# EAGLE schematic LDAQ-BASE (EAGLE 9.6.2)
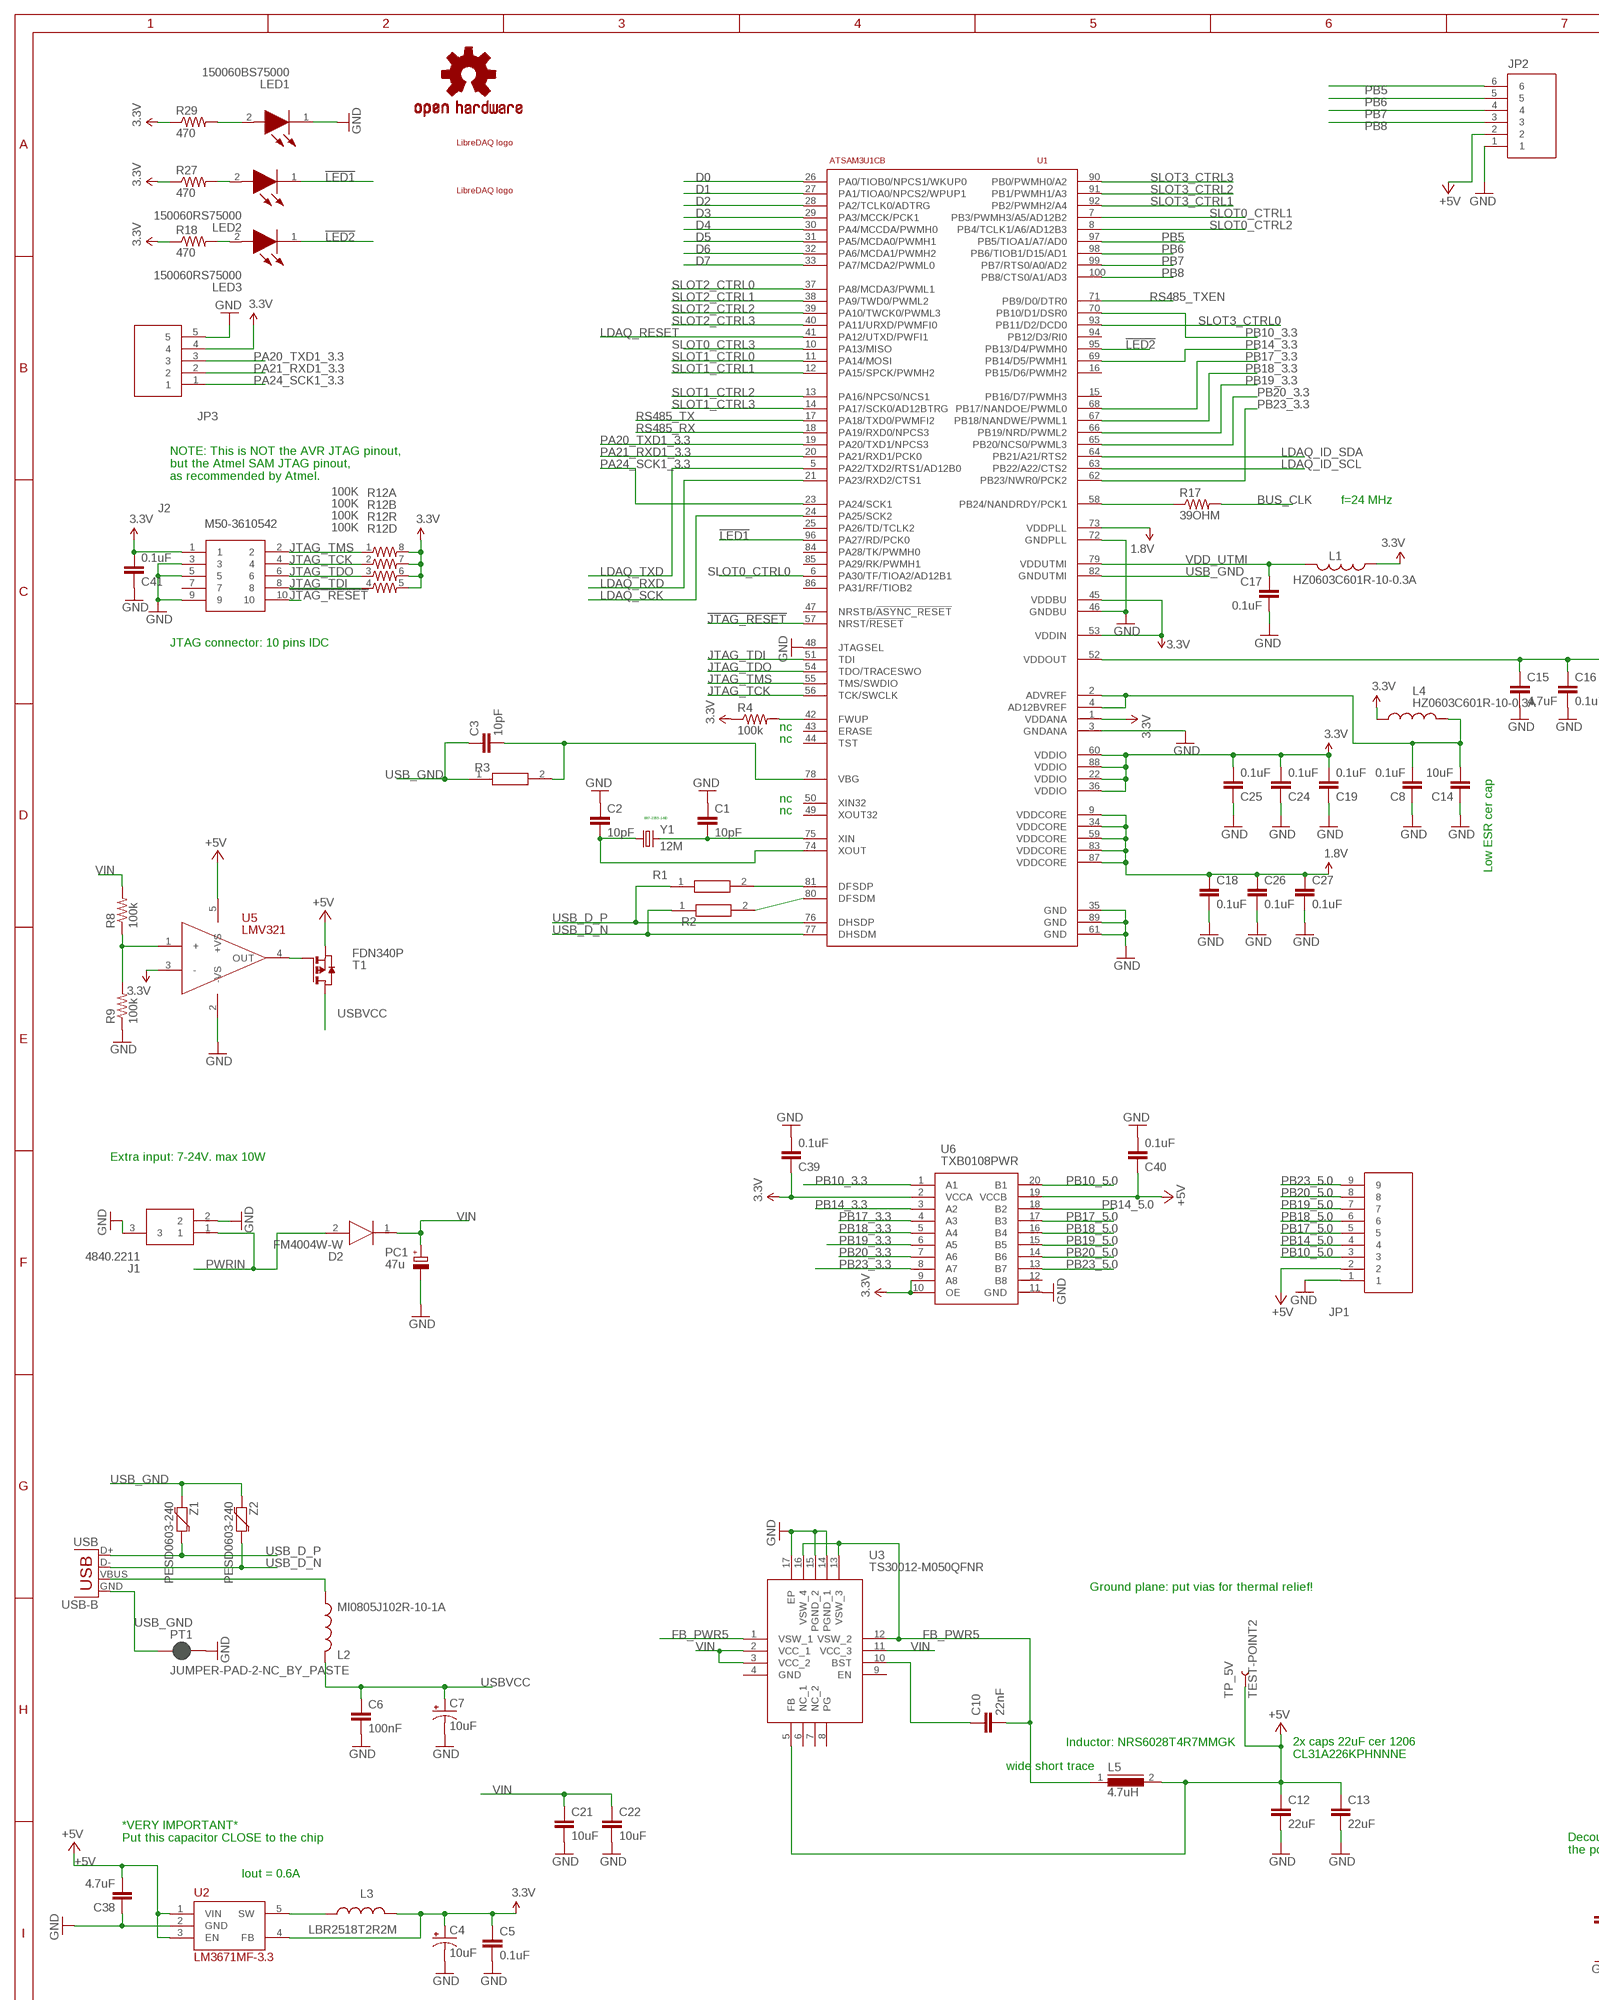
[diagram p0: schematic, sheet 1, part 1 of 2]
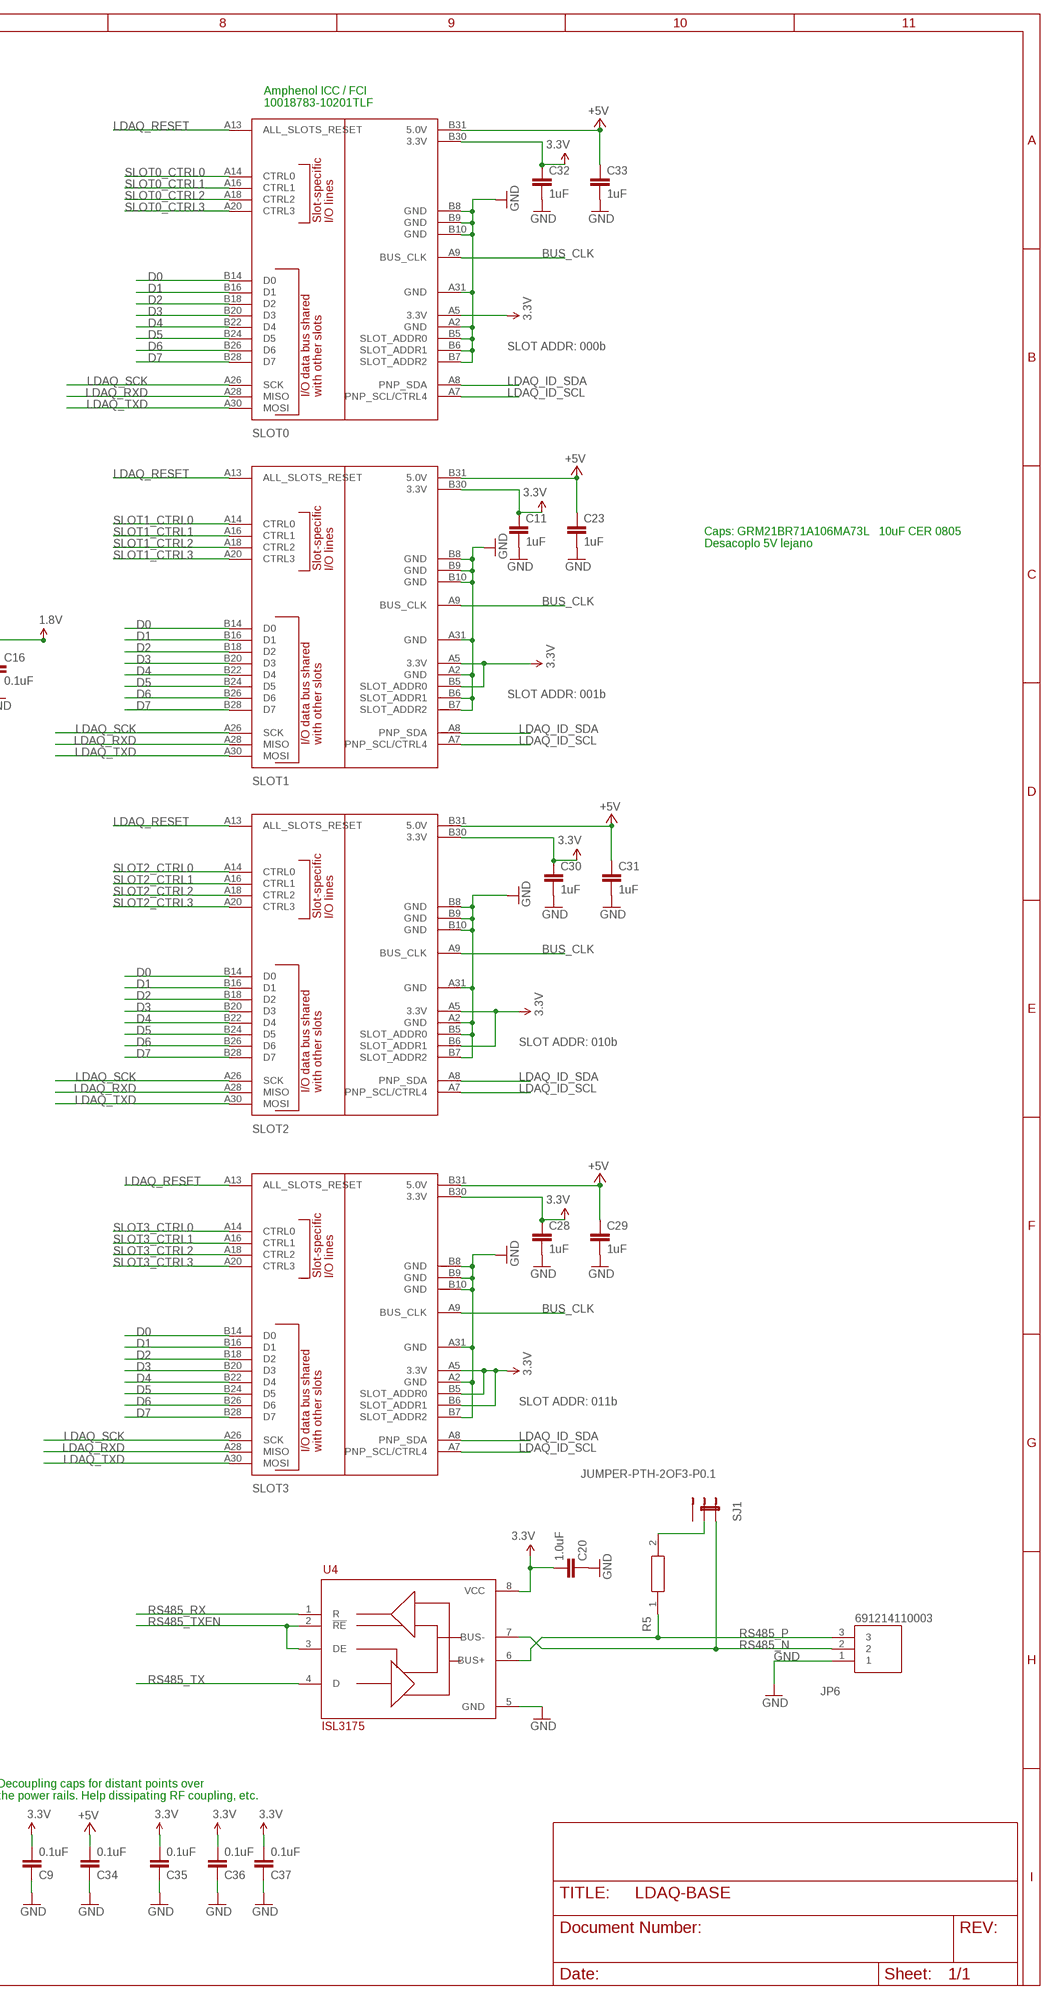
[diagram p1: schematic, sheet 1, part 2 of 2]

## Parts
C1  10pF  22PF-50V-5%(0603)  [0603-CAP]
C2  10pF  22PF-50V-5%(0603)  [0603-CAP]
C3  10pF  10PF-50V-5%(0603)  [0603-CAP]
C4  10uF  10UF-16V-10%(TANT)  [EIA3216]
C5  0.1uF  0.1UF-25V(+80/-20%)(0603)  [0603-CAP]
C6  100nF  CAP0603-CAP  [0603-CAP]
C7  10uF  CAP_POL1206  [EIA3216]
C8  0.1uF  0.1UF-25V(+80/-20%)(0603)  [0603-CAP]
C9  0.1uF  0.1UF-25V(+80/-20%)(0603)  [0603-CAP]
C10  22nF  0.1UF-25V(+80/-20%)(0603)  [0603-CAP]
C11  1uF  CAP-0805  [0805]
C12  22uF  CAP-1206  [1206]
C13  22uF  CAP-1206  [1206]
C14  10uF  10UF-6.3V-20%(0603)  [0603-CAP]
C15  4.7uF  4.7UF-6.3V-10%(0603)0603  [0603-CAP]
C16  0.1uF  0.1UF-25V(+80/-20%)(0603)  [0603-CAP]
C17  0.1uF  0.1UF-25V(+80/-20%)(0603)  [0603-CAP]
C18  0.1uF  0.1UF-25V(+80/-20%)(0603)  [0603-CAP]
C19  0.1uF  0.1UF-25V(+80/-20%)(0603)  [0603-CAP]
C20  1.0uF  1.0UF-16V-10%(0603)  [0603-CAP]
C21  10uF  CAP-1206  [1206]
C22  10uF  CAP-1206  [1206]
C23  1uF  CAP-0805  [0805]
C24  0.1uF  0.1UF-25V(+80/-20%)(0603)  [0603-CAP]
C25  0.1uF  0.1UF-25V(+80/-20%)(0603)  [0603-CAP]
C26  0.1uF  0.1UF-25V(+80/-20%)(0603)  [0603-CAP]
C27  0.1uF  0.1UF-25V(+80/-20%)(0603)  [0603-CAP]
C28  1uF  CAP-0805  [0805]
C29  1uF  CAP-0805  [0805]
C30  1uF  CAP-0805  [0805]
C31  1uF  CAP-0805  [0805]
C32  1uF  CAP-0805  [0805]
C33  1uF  CAP-0805  [0805]
C34  0.1uF  0.1UF-25V(+80/-20%)(0603)  [0603-CAP]
C35  0.1uF  0.1UF-25V(+80/-20%)(0603)  [0603-CAP]
C36  0.1uF  0.1UF-25V(+80/-20%)(0603)  [0603-CAP]
C37  0.1uF  0.1UF-25V(+80/-20%)(0603)  [0603-CAP]
C38  4.7uF  0.1UF-25V(+80/-20%)(0603)  [0603-CAP]
C39  0.1uF  0.1UF-25V(+80/-20%)(0603)  [0603-CAP]
C40  0.1uF  0.1UF-25V(+80/-20%)(0603)  [0603-CAP]
C41  0.1uF  0.1UF-25V(+80/-20%)(0603)  [0603-CAP]
D2  FM4004W-W  [DIOM5025X231N]
J1  4840.2211  [48402211]
J2  M50-3610542  [M503610542]
JP1  39357-0009  [393570009]
JP2  1984659  [1984659]
JP3  1984646  [1984646]
JP6  691214110003  [691214110003]
L1  HZ0603C601R-10-0.3A  INDUCTOR0603  [0603]
L2  MI0805J102R-10-1A  INDUCTOR0805  [0805]
L3  LBR2518T2R2M  INDUCTOR1007  [1007]
L4  HZ0603C601R-10-0.3A  INDUCTOR0603  [0603]
L5  4.7uH  INDUCTOR  [INDUCTOR_6028]
LED1  150060BS75000  [LEDC1608X80N]
LED2  150060RS75000  [LEDC1608X80N]
LED3  150060RS75000  [LEDC1608X80N]
LOGO1  OSHW-LOGOL  [OSHW-LOGO-L]
PC1  47u  CPOL-EUD  [PANASONIC_D]
PT1  JUMPER-PAD-2-NC_BY_PASTE  [PAD-JUMPER-2-NC_BY_PASTE_YES_SILK]
R1  CR1206-FX-39R0ELF  [RESC3216X75N]
R2  CR1206-FX-39R0ELF  [RESC3216X75N]
R3  SFR03EZPF6801  [RESC1608X55N]
R4  100k  100KOHM-1/10W-1%(0603)  [0603-RES]
R5  CRCW0603120RFKEAC  [RESC1608X55N]
R8  100k  100KOHM-1/10W-1%(0603)  [0603-RES]
R9  100k  100KOHM-1/10W-1%(0603)  [0603-RES]
R12  100K  RESISTOR-ARRAY0603-ARV  [0603-ARV]
R17  39OHM  33OHM1/10W1%(0603)  [0603@1]
R18  470  470OHM1/10W1%(0603)  [0603-RES]
R27  470  470OHM1/10W1%(0603)  [0603-RES]
R29  470  470OHM1/10W1%(0603)  [0603-RES]
SJ1  JUMPER-PTH-2OF3-P0.1  [1X03_LONGPADS]
SLOT0  SLOT  LIBREDAQ_DAUGHTER_BOARDPCI-E64-CONN  [PCI-E_64_PTH_CONN]
SLOT1  SLOT  LIBREDAQ_DAUGHTER_BOARDPCI-E64-CONN  [PCI-E_64_PTH_CONN]
SLOT2  SLOT  LIBREDAQ_DAUGHTER_BOARDPCI-E64-CONN  [PCI-E_64_PTH_CONN]
SLOT3  SLOT  LIBREDAQ_DAUGHTER_BOARDPCI-E64-CONN  [PCI-E_64_PTH_CONN]
T1  FDN340P  PMOSSOT23  [SOT-23]
TP_5V  TEST-POINT2  [PAD.02X.02]
U1  ATSAM3U1CB  [TQFP100]
U2  LM3671MF-3.3  [TOP23-5]
U3  TS30012-M050QFNR  [QFN50P300X300X100-17N]
U4  ISL3175  [SOIC8]
U5  LMV321  [SOT353-SC70-5]
U6  TXB0108PWR  [SOP65P640X120-20N]
U$1  LIBREDAQ_LOGO_MINILOGO_GENERIC  [LIBREDAQ_LOGO]
U$6  LOGO_INDALO  [LIBREDAQ_LOGO_INDALO_ALMERIA]
USB  USB-B  USBPTH  [USB-B-PTH]
Y1  12M  CRYSTAL5X3  [CRYSTAL-SMD-5X3]
Z1  PESD0603-240  VARISTOR-0603  [0603-RES]
Z2  PESD0603-240  VARISTOR-0603  [0603-RES]

## Nets
1.8V: C15.1 C16.1 C18.1 C26.1 C27.1 U1.9(VDDCORE) U1.34(VDDCORE) U1.52(VDDOUT) U1.59(VDDCORE) U1.73(VDDPLL) U1.83(VDDCORE) U1.87(VDDCORE)
3.3V: C4.A(+) C5.1 C9.2 C11.1 C19.2 C20.2 C24.2 C25.2 C28.1 C30.1 C32.1 C35.2 C36.2 C37.2 C39.1 C41.2 J2.1 JP3.4 L1.2 L3.2 L4.1 R4.1 R12.5 R12.6 R12.7 R12.8 R18.1 R27.1 R29.1 SLOT0.A5(3.3V) SLOT0.B30(3.3V) SLOT1.A5(3.3V) SLOT1.B5(SLOT_ADDR0) SLOT1.B30(3.3V) SLOT2.A5(3.3V) SLOT2.B6(SLOT_ADDR1) SLOT2.B30(3.3V) SLOT3.A5(3.3V) SLOT3.B5(SLOT_ADDR0) SLOT3.B6(SLOT_ADDR1) SLOT3.B30(3.3V) U1.1(VDDANA) U1.22(VDDIO) U1.36(VDDIO) U1.45(VDDBU) U1.53(VDDIN) U1.60(VDDIO) U1.88(VDDIO) U2.4(FB) U4.8(VCC) U5.3(-) U6.2(VCCA) U6.9(A8) U6.10(OE)
!JTAG_RESET: J2.10 U1.57(NRST/!RESET)
!LED1: LED2.1(K) U1.96(PA27/RD/PCK0)
!LED2: LED3.1(K) U1.95(PB13/D4/PWMH0)
+5V: C12.1 C13.1 C23.1 C29.1 C31.1 C33.1 C34.2 C38.2 C40.1 JP1.2 JP2.2 L5.2 SLOT0.B31(5.0V) SLOT1.B31(5.0V) SLOT2.B31(5.0V) SLOT3.B31(5.0V) T1.2(S) TP_5V.P$1 U2.1(VIN) U2.3(EN) U3.5(FB) U5.5(+VS) U6.19(VCCB)
BUS_CLK: R17.2 SLOT0.A9(BUS_CLK) SLOT1.A9(BUS_CLK) SLOT2.A9(BUS_CLK) SLOT3.A9(BUS_CLK)
CMP: R8.1 R9.2 U5.1(+)
D0: SLOT0.B14(D0) SLOT1.B14(D0) SLOT2.B14(D0) SLOT3.B14(D0) U1.26(PA0/TIOB0/NPCS1/WKUP0)
D1: SLOT0.B16(D1) SLOT1.B16(D1) SLOT2.B16(D1) SLOT3.B16(D1) U1.27(PA1/TIOA0/NPCS2/WPUP1)
D2: SLOT0.B18(D2) SLOT1.B18(D2) SLOT2.B18(D2) SLOT3.B18(D2) U1.28(PA2/TCLK0/ADTRG)
D3: SLOT0.B20(D3) SLOT1.B20(D3) SLOT2.B20(D3) SLOT3.B20(D3) U1.29(PA3/MCCK/PCK1)
D4: SLOT0.B22(D4) SLOT1.B22(D4) SLOT2.B22(D4) SLOT3.B22(D4) U1.30(PA4/MCCDA/PWMH0)
D5: SLOT0.B24(D5) SLOT1.B24(D5) SLOT2.B24(D5) SLOT3.B24(D5) U1.31(PA5/MCDA0/PWMH1)
D6: SLOT0.B26(D6) SLOT1.B26(D6) SLOT2.B26(D6) SLOT3.B26(D6) U1.32(PA6/MCDA1/PWMH2)
D7: SLOT0.B28(D7) SLOT1.B28(D7) SLOT2.B28(D7) SLOT3.B28(D7) U1.33(PA7/MCDA2/PWML0)
FB_PWR5: C10.2 L5.1 U3.1(VSW_1) U3.12(VSW_2) U3.13(VSW_3) U3.16(VSW_4)
GND: C1.1 C2.1 C4.C(-) C5.2 C6.2 C7.C(-) C8.1 C9.1 C11.2 C12.2 C13.2 C14.1 C15.2 C16.2 C17.2 C18.2 C19.1 C20.1 C21.2 C22.2 C23.2 C24.1 C25.1 C26.2 C27.2 C28.2 C29.2 C30.2 C31.2 C32.2 C33.2 C34.1 C35.1 C36.1 C37.1 C38.1 C39.2 C40.2 C41.1 J1.2 J1.3 J2.3 J2.5 J2.9 JP1.1 JP2.1 JP3.5 JP6.1 LED1.1(K) PC1.- PT1.2 R9.1 SLOT0.A2(GND) SLOT0.A31(GND) SLOT0.B5(SLOT_ADDR0) SLOT0.B6(SLOT_ADDR1) SLOT0.B7(SLOT_ADDR2) SLOT0.B8(GND) SLOT0.B9(GND) SLOT0.B10(GND) SLOT1.A2(GND) SLOT1.A31(GND) SLOT1.B6(SLOT_ADDR1) SLOT1.B7(SLOT_ADDR2) SLOT1.B8(GND) SLOT1.B9(GND) SLOT1.B10(GND) SLOT2.A2(GND) SLOT2.A31(GND) SLOT2.B5(SLOT_ADDR0) SLOT2.B7(SLOT_ADDR2) SLOT2.B8(GND) SLOT2.B9(GND) SLOT2.B10(GND) SLOT3.A2(GND) SLOT3.A31(GND) SLOT3.B7(SLOT_ADDR2) SLOT3.B8(GND) SLOT3.B9(GND) SLOT3.B10(GND) U1.3(GNDANA) U1.35(GND) U1.46(GNDBU) U1.48(JTAGSEL) U1.61(GND) U1.72(GNDPLL) U1.89(GND) U2.2(GND) U3.14(PGND_1) U3.15(PGND_2) U3.17(EP) U4.5(GND) U5.2(-VS) U6.11(GND)
JTAG_TCK: J2.4 R12.2 U1.56(TCK/SWCLK)
JTAG_TDI: J2.8 R12.4 U1.51(TDI)
JTAG_TDO: J2.6 R12.3 U1.54(TDO/TRACESWO)
JTAG_TMS: J2.2 R12.1 U1.55(TMS/SWDIO)
LDAQ_ID_SCL: SLOT0.A7(PNP_SCL/CTRL4) SLOT1.A7(PNP_SCL/CTRL4) SLOT2.A7(PNP_SCL/CTRL4) SLOT3.A7(PNP_SCL/CTRL4) U1.63(PB22/A22/CTS2)
LDAQ_ID_SDA: SLOT0.A8(PNP_SDA) SLOT1.A8(PNP_SDA) SLOT2.A8(PNP_SDA) SLOT3.A8(PNP_SDA) U1.64(PB21/A21/RTS2)
LDAQ_RESET: SLOT0.A13(ALL_SLOTS_RESET) SLOT1.A13(ALL_SLOTS_RESET) SLOT2.A13(ALL_SLOTS_RESET) SLOT3.A13(ALL_SLOTS_RESET) U1.41(PA12/UTXD/PWFI1)
LDAQ_RXD: SLOT0.A28(MISO) SLOT1.A28(MISO) SLOT2.A28(MISO) SLOT3.A28(MISO) U1.21(PA23/RXD2/CTS1)
LDAQ_SCK: SLOT0.A26(SCK) SLOT1.A26(SCK) SLOT2.A26(SCK) SLOT3.A26(SCK) U1.24(PA25/SCK2)
LDAQ_TXD: SLOT0.A30(MOSI) SLOT1.A30(MOSI) SLOT2.A30(MOSI) SLOT3.A30(MOSI) U1.5(PA22/TXD2/RTS1/AD12B0)
N$1: C1.2 U1.75(XIN) Y1.3
N$2: C2.2 U1.74(XOUT) Y1.1
N$3: R1.2 U1.81(DFSDP)
N$4: R2.2 U1.80(DFSDM)
N$5: C3.2 R3.2 U1.78(VBG)
N$6: R4.2 U1.42(FWUP)
N$11: L2.2 USB.VBUS
N$12: L3.1 U2.5(SW)
N$15: R5.2 SJ1.2
N$16: LED1.2(A) R29.2
N$17: C10.1 U3.10(BST)
N$18: T1.3(G) U5.4(OUT)
N$27: R17.1 U1.58(PB24/NANDRDY/PCK1)
N$30: C8.2 C14.2 L4.2 U1.2(ADVREF) U1.4(AD12BVREF)
N$31: LED2.2(A) R27.2
N$32: LED3.2(A) R18.2
PA20_TXD1_3.3: JP3.3 U1.19(PA20/TXD1/NPCS3)
PA21_RXD1_3.3: JP3.2 U1.20(PA21/RXD1/PCK0)
PA24_SCK1_3.3: JP3.1 U1.23(PA24/SCK1)
PB5: JP2.6 U1.97(PB5/TIOA1/A7/AD0)
PB6: JP2.5 U1.98(PB6/TIOB1/D15/AD1)
PB7: JP2.4 U1.99(PB7/RTS0/A0/AD2)
PB8: JP2.3 U1.100(PB8/CTS0/A1/AD3)
PB10_3.3: U1.70(PB10/D1/DSR0) U6.1(A1)
PB10_5.0: JP1.3 U6.20(B1)
PB14_3.3: U1.69(PB14/D5/PWMH1) U6.3(A2)
PB14_5.0: JP1.4 U6.18(B2)
PB17_3.3: U1.68(PB17/NANDOE/PWML0) U6.4(A3)
PB17_5.0: JP1.5 U6.17(B3)
PB18_3.3: U1.67(PB18/NANDWE/PWML1) U6.5(A4)
PB18_5.0: JP1.6 U6.16(B4)
PB19_3.3: U1.66(PB19/NRD/PWML2) U6.6(A5)
PB19_5.0: JP1.7 U6.15(B5)
PB20_3.3: U1.65(PB20/NCS0/PWML3) U6.7(A6)
PB20_5.0: JP1.8 U6.14(B6)
PB23_3.3: U1.62(PB23/NWR0/PCK2) U6.8(A7)
PB23_5.0: JP1.9 U6.13(B7)
PWRIN [power]: D2.2(A) J1.1
RS485_N: JP6.2 SJ1.1 U4.7(BUS-)
RS485_P: JP6.3 R5.1 U4.6(BUS+)
RS485_RX: U1.18(PA19/RXD0/NPCS3) U4.1(R)
RS485_TX: U1.17(PA18/TXD0/PWMFI2) U4.4(D)
RS485_TXEN: U1.71(PB9/D0/DTR0) U4.2(!RE) U4.3(DE)
SLOT0_CTRL0: SLOT0.A14(CTRL0) U1.6(PA30/TF/TIOA2/AD12B1)
SLOT0_CTRL1: SLOT0.A16(CTRL1) U1.7(PB3/PWMH3/A5/AD12B2)
SLOT0_CTRL2: SLOT0.A18(CTRL2) U1.8(PB4/TCLK1/A6/AD12B3)
SLOT0_CTRL3: SLOT0.A20(CTRL3) U1.10(PA13/MISO)
SLOT1_CTRL0: SLOT1.A14(CTRL0) U1.11(PA14/MOSI)
SLOT1_CTRL1: SLOT1.A16(CTRL1) U1.12(PA15/SPCK/PWMH2)
SLOT1_CTRL2: SLOT1.A18(CTRL2) U1.13(PA16/NPCS0/NCS1)
SLOT1_CTRL3: SLOT1.A20(CTRL3) U1.14(PA17/SCK0/AD12BTRG)
SLOT2_CTRL0: SLOT2.A14(CTRL0) U1.37(PA8/MCDA3/PWML1)
SLOT2_CTRL1: SLOT2.A16(CTRL1) U1.38(PA9/TWD0/PWML2)
SLOT2_CTRL2: SLOT2.A18(CTRL2) U1.39(PA10/TWCK0/PWML3)
SLOT2_CTRL3: SLOT2.A20(CTRL3) U1.40(PA11/URXD/PWMFI0)
SLOT3_CTRL0: SLOT3.A14(CTRL0) U1.93(PB11/D2/DCD0)
SLOT3_CTRL1: SLOT3.A16(CTRL1) U1.92(PB2/PWMH2/A4)
SLOT3_CTRL2: SLOT3.A18(CTRL2) U1.91(PB1/PWMH1/A3)
SLOT3_CTRL3: SLOT3.A20(CTRL3) U1.90(PB0/PWMH0/A2)
USB_D_N: R2.1 U1.77(DHSDM) USB.D- Z2.2
USB_D_P: R1.1 U1.76(DHSDP) USB.D+ Z1.2
USB_GND: C3.1 PT1.1 R3.1 U1.82(GNDUTMI) USB.GND Z1.1 Z2.1
USBVCC: C6.1 C7.A(+) L2.1 T1.1(D)
VDD_UTMI: C17.1 L1.1 U1.79(VDDUTMI)
VIN: C21.1 C22.1 D2.1(K) PC1.+ R8.2 U3.2(VCC_1) U3.3(VCC_2) U3.11(VCC_3)
Unconnected: J2.7 SJ1.3 U1.15(PB16/D7/PWMH3) U1.16(PB15/D6/PWMH2) U1.25(PA26/TD/TCLK2) U1.43(ERASE) U1.44(TST) U1.47(NRSTB/!ASYNC_RESET) U1.49(XOUT32) U1.50(XIN32) U1.84(PA28/TK/PWMH0) U1.85(PA29/RK/PWMH1) U1.86(PA31/RF/TIOB2) U1.94(PB12/D3/RI0) U3.4(GND) U3.6(NC_1) U3.7(NC_2) U3.8(PG) U3.9(EN) U6.12(B8)

## Notes on the sheet
- Amphenol ICC / FCI
  10018783-10201TLF
- SLOT ADDR: 000b
- NOTE: This is NOT the AVR JTAG pinout, 
  but the Atmel SAM JTAG pinout, 
  as recommended by Atmel.
- f=24 MHz
- Caps: GRM21BR71A106MA73L   10uF CER 0805
  Desacoplo 5V lejano
- JTAG connector: 10 pins IDC
- SLOT ADDR: 001b
- nc
- nc
- Low ESR cer cap
- nc
- nc
- 887-2355-1-ND
- SLOT ADDR: 010b
- Extra input: 7-24V. max 10W
- SLOT ADDR: 011b
- Ground plane: put vias for thermal relief!
- Inductor: NRS6028T4R7MMGK
- 2x caps 22uF cer 1206
  CL31A226KPHNNNE
- wide short trace
- *VERY IMPORTANT*
  Put this capacitor CLOSE to the chip
- Decoupling caps for distant points over
  the power rails. Help dissipating RF coupling, etc.
- Iout = 0.6A

## Library data of the parts
C1 C2 = SparkFun-Capacitors:22PF-50V-5%(0603): CAP-07876; PROD_ID: CAP-07876; VALUE: 22pF
C3 = SparkFun-Capacitors:10PF-50V-5%(0603): CAP-11812; PROD_ID: CAP-11812
C4 = SparkFun-Capacitors:10UF-16V-10%(TANT): CAP-00811 1206/EIA-3216 Tantalum capacitor; PROD_ID: CAP-00811
C5 C8 C9 C16-C19 C24-C27 C34-C37 C39-C41 = SparkFun-Capacitors:0.1UF-25V(+80/-20%)(0603): CAP-00810 Ceramic Standard decoupling cap; PROD_ID: CAP-00810
C6 = SparkFun-Passives:CAP: Capacitor Standard 0603 ceramic capacitor, and 0.1" leaded capacitor.
C7 = SparkFun-Capacitors:CAP_POL: Capacitor Polarized These are standard SMD and PTH capacitors. Normally 10uF, 47uF, and 100uF in electrolytic and tantalum varieties. Always verify the external diameter of the through hole cap, it varies with capacity, voltage, and manufacturer. The EIA devices should be standard.
C10 C38 = SparkFun-Capacitors:0.1UF-25V(+80/-20%)(0603): CAP-00810 Ceramic Standard decoupling cap; PROD_ID: CAP-00810; VALUE: 0.1uF
C11-C13 C21-C23 C28-C33 = SparkFun-Capacitors:CAP
C14 = SparkFun-Capacitors:10UF-6.3V-20%(0603): CAP-11015; PROD_ID: CAP-11015
C15 = SparkFun-Capacitors:4.7UF-6.3V-10%(0603): CAP-08280; PROD_ID: CAP-08280
C20 = SparkFun-Capacitors:1.0UF-16V-10%(0603): CAP-00868; PROD_ID: CAP-00868
D2 = FM4004W-W:FM4004W-W: Rectifiers 1A, 400V Source: Datasheet <http://www.rectron.com/public/product_datasheets/fm4001w-fm4007w.pdf>; DESCRIPTION: Rectifiers 1A, 400V; HEIGHT: 2.31mm; MANUFACTURER_NAME: Rectron; MANUFACTURER_PART_NUMBER: FM4004W-W; MOUSER_PART_NUMBER: 583-FM4004W-W; MOUSER_PRICE-STOCK: https://www.mouser.co.uk/ProductDetail/Rectron/FM4004W-W?qs=jY2200qj%252BWB%252ByCHJbbmOqA%3D%3D
J1 = SamacSys_Parts:4840.2211: DC Power Connectors DC SOCKET 2.35MM PCB MOUNT Source: Datasheet <http://www.schurterinc.com/bundles/snceschurter/epim/_ProdPool_/newDS/en/typ_4840.2211.pdf>; DESCRIPTION: DC Power Connectors DC SOCKET 2.35MM PCB MOUNT; HEIGHT: 11mm; MANUFACTURER_NAME: SCHURTER; MANUFACTURER_PART_NUMBER: 4840.2211; MOUSER_PART_NUMBER: 693-4840.2211; MOUSER_PRICE-STOCK: https://www.mouser.co.uk/ProductDetail/Schurter/48402211?qs=wwP%252BWDYHj0YnjLRL9j928g%3D%3D
J2 = SamacSys_Parts:M50-3610542: HARWIN - M50-3610542 - CONNECTOR, HEADER, 10POS, 2ROW, 1.27MM Source: Datasheet <https://cdn.harwin.com/pdfs/M50-361.pdf>; DESCRIPTION: HARWIN - M50-3610542 - CONNECTOR, HEADER, 10POS, 2ROW, 1.27MM; HEIGHT: 5.03mm; MANUFACTURER_NAME: Harwin; MANUFACTURER_PART_NUMBER: M50-3610542; MOUSER_PART_NUMBER: 855-M50-3610542; MOUSER_PRICE-STOCK: https://www.mouser.co.uk/ProductDetail/Harwin/M50-3610542?qs=wpKP3X6Fz6rduxWSJOLkHQ%3D%3D
JP1 = SamacSys_Parts:39357-0009: Fixed Terminal Blocks 3.5MM FIXED PCB 9P 16-26AWG Source: Datasheet <https://www.molex.com/pdm_docs/sd/393570009_sd.pdf>; DESCRIPTION: Fixed Terminal Blocks 3.5MM FIXED PCB 9P 16-26AWG; HEIGHT: 8.81mm; MANUFACTURER_NAME: Molex; MANUFACTURER_PART_NUMBER: 39357-0009; MOUSER_PART_NUMBER: 538-39357-0009; MOUSER_PRICE-STOCK: https://www.mouser.co.uk/ProductDetail/Molex/39357-0009?qs=z57USrEQgt0ZhpMzXOYyqQ%3D%3D
JP2 = SamacSys_Parts:1984659: Fixed Terminal Blocks PT 1.5/6-3.5H 6POS HRZ 3.5mm SCREW Source: Datasheet; DESCRIPTION: Fixed Terminal Blocks PT 1.5/6-3.5H 6POS HRZ 3.5mm SCREW; HEIGHT: 9.3mm; MANUFACTURER_NAME: Phoenix Contact; MANUFACTURER_PART_NUMBER: 1984659; MOUSER_PART_NUMBER: 651-1984659; MOUSER_PRICE-STOCK: https://www.mouser.co.uk/ProductDetail/Phoenix-Contact/1984659/?qs=FQYO1eEgUPBU2UOuKgfwDQ%3D%3D
JP3 = SamacSys_Parts:1984646: Phoenix Contact, COMBICON PT 3.5mm Pitch, 5 Way PCB Terminal Strip Source: Datasheet <https://www.phoenixcontact.com/online/portal/in?uri=pxc-oc-itemdetail:pid=1984646&library=inen&tab=1>; DESCRIPTION: Phoenix Contact, COMBICON PT 3.5mm Pitch, 5 Way PCB Terminal Strip; HEIGHT: 9.3mm; MANUFACTURER_NAME: Phoenix Contact; MANUFACTURER_PART_NUMBER: 1984646
JP6 = 691214110003:691214110003: WR-TBL Terminal block - serie 2141 Source: Datasheet <https://katalog.we-online.de/em/datasheet/6912141100xx.pdf>; DESCRIPTION: WR-TBL Terminal block - serie 2141; HEIGHT: 8.5mm; MANUFACTURER_NAME: Wurth Elektronik; MANUFACTURER_PART_NUMBER: 691214110003; MOUSER_PART_NUMBER: 710-691214110003; MOUSER_PRICE-STOCK: https://www.mouser.co.uk/ProductDetail/Wurth-Elektronik/691214110003/?qs=7gQLVZk5cPlrsv0RXQNEtw%3D%3D
L1-L4 = SparkFun-Passives:INDUCTOR: Inductors Basic Inductor/Choke - 0603 and 1206. Footprints are not proven and vary greatly between part numbers. SRN6045- 33uH, 20% 1.4A SDR0403-560KL - 56uH, 10%, 500mA RMS/740mA peak
L5 = libredaq-comps:INDUCTOR: Inductor
LED1 = SamacSys_Parts:150060BS75000: LED,Wurth Elektronik,150060BS75000 Wurth Elektronik 150060BS75000, WL-SMCW Series Blue LED, 470 nm 1608 (0603) Clear, Rectangle Lens SMD package Source: Datasheet <https://componentsearchengine.com/Datasheets/2/150060BS75000.pdf>; DESCRIPTION: LED,Wurth Elektronik,150060BS75000 Wurth Elektronik 150060BS75000, WL-SMCW Series Blue LED, 470 nm 1608 (0603) Clear, Rectangle Lens SMD package; HEIGHT: 0.8mm; MANUFACTURER_NAME: Wurth Elektronik; MANUFACTURER_PART_NUMBER: 150060BS75000; MOUSER_PART_NUMBER: 710-150060BS75000; MOUSER_PRICE-STOCK: https://www.mouser.co.uk/ProductDetail/Wurth-Elektronik/150060BS75000/?qs=LlUlMxKIyB2DLLpXQThavA%3D%3D
LED2 LED3 = SamacSys_Parts:150060RS75000: WURTH ELEKTRONIK - 150060RS75000 - LED, 0603, RED, 250MCD, 625NM Source: Datasheet <http://katalog.we-online.de/led/datasheet/150060RS75000.pdf>; DESCRIPTION: WURTH ELEKTRONIK - 150060RS75000 - LED, 0603, RED, 250MCD, 625NM; HEIGHT: 0.8mm; MANUFACTURER_NAME: Wurth Elektronik; MANUFACTURER_PART_NUMBER: 150060RS75000; MOUSER_PART_NUMBER: 710-150060RS75000; MOUSER_PRICE-STOCK: https://www.mouser.co.uk/ProductDetail/Wurth-Elektronik/150060RS75000/?qs=LlUlMxKIyB3QnmZ3fw%2FVCA%3D%3D
LOGO1 = SparkFun-Aesthetics:OSHW-LOGO: Open-Source Hardware (OSHW) Logo This logo indicates the piece of hardware it is found on incorporates a OSHW license and/or adheres to the definition of open source hardware found here: http://freedomdefined.org/OSHW
PC1 = rcl:CPOL-EU: POLARIZED CAPACITOR, European symbol
PT1 = SparkFun-Passives:JUMPER-PAD-2-NC_BY_PASTE
R1 R2 = SamacSys_Parts:CR1206-FX-39R0ELF: Thick Film Resistors - SMD 39ohm 1% Source: Datasheet <https://componentsearchengine.com/Datasheets/1/CR1206-FX-39R0ELF.pdf>; DESCRIPTION: Thick Film Resistors - SMD 39ohm 1%; HEIGHT: 0.75mm; MANUFACTURER_NAME: Bourns; MANUFACTURER_PART_NUMBER: CR1206-FX-39R0ELF; MOUSER_PART_NUMBER: 652-CR1206FX-39R0ELF; MOUSER_PRICE-STOCK: https://www.mouser.com/Search/Refine.aspx?Keyword=652-CR1206FX-39R0ELF
R3 = SamacSys_Parts:SFR03EZPF6801: Thick Film Resistors - SMD 0603 6.8Kohms 1% Anti-Sulfur AEC-Q200 Source: Datasheet <https://www.mouser.de/datasheet/2/348/sfr-e-1507454.pdf>; DESCRIPTION: Thick Film Resistors - SMD 0603 6.8Kohms 1% Anti-Sulfur AEC-Q200; HEIGHT: 0.55mm; MANUFACTURER_NAME: ROHM Semiconductor; MANUFACTURER_PART_NUMBER: SFR03EZPF6801
R4 R8 R9 = SparkFun-Resistors:100KOHM-1/10W-1%(0603): RES-07828; PROD_ID: RES-07828
R5 = SamacSys_Parts:CRCW0603120RFKEAC: D11/CRCW0603-C 100 120R 1% ET1 Source: Datasheet <https://componentsearchengine.com/Datasheets/1/CRCW0603120RFKEAC.pdf>; DESCRIPTION: D11/CRCW0603-C 100 120R 1% ET1; HEIGHT: 0.55mm; MANUFACTURER_NAME: Vishay; MANUFACTURER_PART_NUMBER: CRCW0603120RFKEAC; MOUSER_PART_NUMBER: 71-CRCW0603120RFKEAC; MOUSER_PRICE-STOCK: https://www.mouser.co.uk/ProductDetail/Vishay-Dale/CRCW0603120RFKEAC/?qs=E3Y5ESvWgWMGFoE2FJoeMw%3D%3D
R12 = SparkFun-Resistors:RESISTOR-ARRAY: Array Chip Resistor Source: RS Component / Phycomp
R17 = SparkFun-Resistors:33OHM1/10W1%(0603): RES-08270; PROD_ID: RES-08270; VALUE: 33OHM
R18 R27 R29 = SparkFun-Resistors:470OHM1/10W1%(0603): RES-07869; PROD_ID: RES-07869
SJ1 = libredaq-comps:JUMPER-PTH-2OF3-P0.1
SLOT0 SLOT1-SLOT3 = libredaq-comps:LIBREDAQ_DAUGHTER_BOARD: LibreDAQ Expansion board (PCI-E form)
T1 = zetex:PMOSSOT23: MOS FET; OC_FARNELL: unknown; OC_NEWARK: unknown
TP_5V = SparkFun-Passives:TEST-POINT: Bare copper test points for troubleshooting or ICT
U1 = libredaq-comps:ATSAM3U1CB: 100-pin SAM3U4/2/1C Atmel microcontroller (ATSAM3U{1/2/4}CB) - VDDIO: 1.62-3.6V - VDDIN: 1.8V-3.6V - VDDOUT: 1.8V - VDDUTMII: 3.0-3.6V - VDDBU: (backup I/O) 1.62-3.6V - VDDPLL: 1.62-1.95V - VDDANA: 2.0-3.6V - VDDCORE: 1.62-1.95V
U2 = libredaq-comps:LM3671MF-3.3: LM3671/-Q1 2-MHz, 600-mA Step-Down DC-DC Converter
U3 = TS30012-M050QFNR:TS30012-M050QFNR: Switching Voltage Regulators IC Hi-Eff 2Amp DC/DC Conv 1MHz 5V Outpt Source: Datasheet <https://www.semtech.com/uploads/documents/ts30011_12_13.pdf>; DESCRIPTION: Switching Voltage Regulators IC Hi-Eff 2Amp DC/DC Conv 1MHz 5V Outpt; HEIGHT: 1mm; MANUFACTURER_NAME: SEMTECH; MANUFACTURER_PART_NUMBER: TS30012-M050QFNR; MOUSER_PART_NUMBER: 947-TS30012-M050QFNR; MOUSER_PRICE-STOCK: https://www.mouser.co.uk/ProductDetail/Semtech/TS30012-M050QFNR?qs=EumP11lMQtNuaw%252Bpmi6RbA%3D%3D
U4 = libredaq-comps:ISL3175: The Intersil ISL317XE are ±15kV IEC61000 ESD Protected, 3.3V-powered, single transceivers that meet both the RS-485 and RS-422 standards for balanced communication.
U5 = libredaq-comps:LMV321: The LMV321 (single), LMV358 (dual), and LMV324 (quad) are a low cost, voltage feedback amplifiers that consume only 80µA of supply current per amplifier. The LMV3XX family is designed to operate from 2.7V (±1.35V) to 5.5V (±2.75V) supplies.
U6 = TXB0108PWR:TXB0108PWR: 8-Bit Bidirectional Voltage-Level Shifter with Auto Direction Sensing and +/-15-kV ESD Protect Source: Datasheet <http://www.ti.com/lit/ds/symlink/txb0108.pdf>; DESCRIPTION: 8-Bit Bidirectional Voltage-Level Shifter with Auto Direction Sensing and +/-15-kV ESD Protect; HEIGHT: 1.2mm; MANUFACTURER_NAME: Texas Instruments; MANUFACTURER_PART_NUMBER: TXB0108PWR; MOUSER_PART_NUMBER: 595-TXB0108PWR; MOUSER_PRICE-STOCK: https://www.mouser.co.uk/ProductDetail/Texas-Instruments/TXB0108PWR/?qs=oFXvjAmG9EgEUWGWzOVFCA%3D%3D
U$1 = libredaq-comps:LIBREDAQ_LOGO_MINI
U$6 = libredaq-comps:LOGO_INDALO
USB = SparkFun-Connectors:USB: USB Connectors USB-B-PTH is fully proven SKU : PRT-00139/CONN-08278 USB-miniB is fully proven SKU : PRT-00587 USB-A-PCB is untested. USB-A-H is throughly reviewed, but untested. Spark Fun Electronics SKU : PRT-00437 USB-B-SMT is throughly reviewed, but untested. Needs silkscreen touching up. USB-A-S has not been used/tested USB-MB-H has not been used/tested USB-MICROB has been used. CONN-09505; PROD_ID: CONN-08278
Y1 = SparkFun-FreqCtrl:CRYSTAL: Various standard crystals. Proven footprints.; PROD_ID: XTAL-08218
Z1 Z2 = SparkFun-DiscreteSemi:VARISTOR: Varistor Varistor (Variable resistor) is a nonlinear resistive element of the voltage dependence that resistance changes with applied voltage. Varistor is equivalent with Zener diode of two series connection.